# Altium schematic sheet I2C.SchDoc
size A4
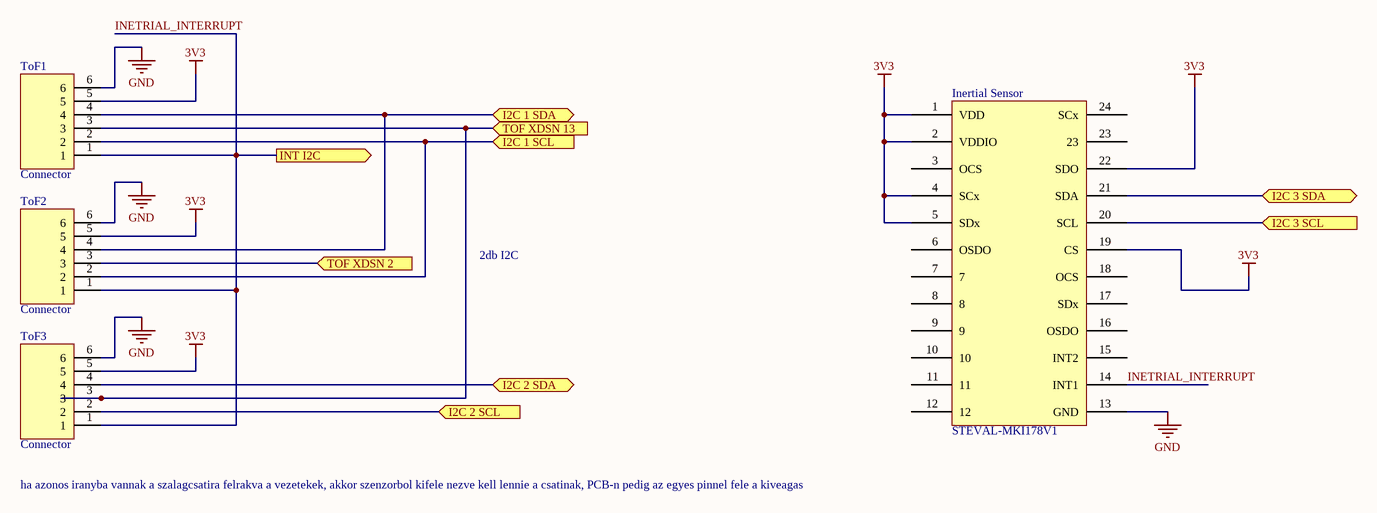
[diagram p0: I2C.SchDoc]

## Parts
Inertial_Sensor  STEVAL-MKI178V1  [STEVAL-MKI178V1]
ToF1  Connector  [FP_CONN6PIN_2X3_254]
ToF2  Connector  [FP_CONN6PIN_2X3_254]
ToF3  Connector  [FP_CONN6PIN_2X3_254]

## Ports
I2C 1 SCL (in), I2C 1 SDA (bidir), I2C 2 SCL (in), I2C 2 SDA (bidir), I2C 3 SCL (in), I2C 3 SDA (bidir), INT I2C (out), TOF XDSN 2 (in), TOF XDSN 13 (in)

## Nets
3V3: Inertial_Sensor.1(VDD) Inertial_Sensor.2(VDDIO) Inertial_Sensor.4(SCx) Inertial_Sensor.5(SDx) Inertial_Sensor.19(CS) Inertial_Sensor.22(SDO) ToF1.5 ToF2.5 ToF3.5
GND: Inertial_Sensor.13(GND) ToF1.6 ToF2.6 ToF3.6
I2C 1 SCL: ToF1.2 ToF2.2 ; port I2C 1 SCL
I2C 1 SDA: ToF1.4 ToF2.4 ; port I2C 1 SDA
I2C 2 SCL: ToF3.2 ; port I2C 2 SCL
I2C 2 SDA: ToF3.4 ; port I2C 2 SDA
I2C 3 SCL: Inertial_Sensor.20(SCL) ; port I2C 3 SCL
I2C 3 SDA: Inertial_Sensor.21(SDA) ; port I2C 3 SDA
INETRIAL_INTERRUPT: Inertial_Sensor.14(INT1) ToF1.1 ToF2.1 ToF3.1 ; port INT I2C
TOF XDSN 2: ToF2.3 ; port TOF XDSN 2
TOF XDSN 13: ToF1.3 ToF3.3 ; port TOF XDSN 13

Not connected (* = marked no-connect by the designer): Inertial_Sensor 3(OCS) 6(OSDO) 7 8 9 10 11 12 15(INT2) 16(OSDO) 17(SDx) 18(OCS) 23 24(SCx)

## Notes on the sheet
- 2db I2C
- ha azonos iranyba vannak a szalagcsatira felrakva a vezetekek, akkor szenzorbol kifele nezve kell lennie a csatinak, PCB-n pedig az egyes pinnel fele a kiveagas

## Library data of the parts
ToF1-ToF3 = Connector_6pin: 6pin connector